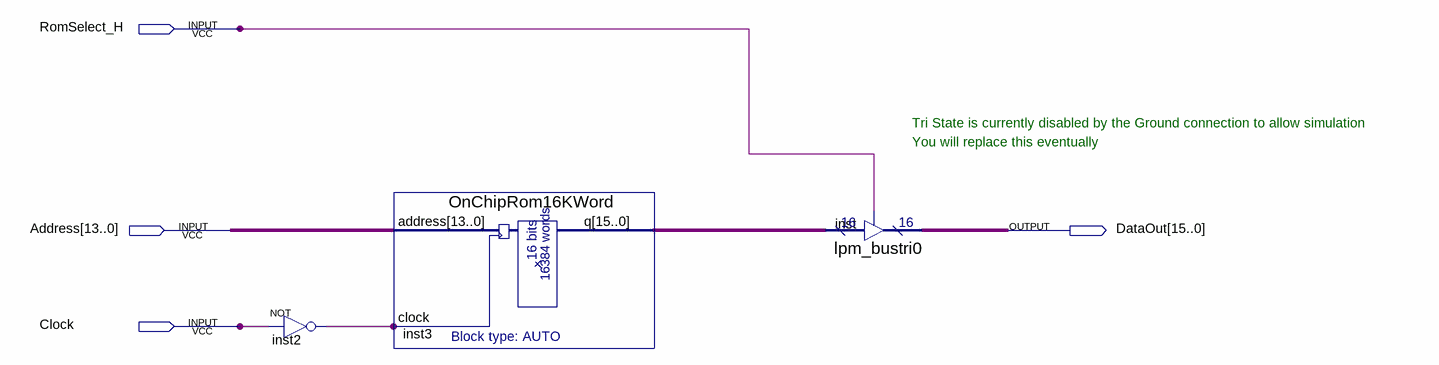
[diagram p0: schematic sheet]
// Quartus schematic OnChipROM16KWords.bdf as structural Verilog: 3 symbols, 4 pins
module OnChipROM16KWords (
  input  RomSelect_H,
  input  [13:0] Address,
  input  Clock,
  output [15:0] DataOut
);

  wire inst2_out;
  wire [15:0] inst3_q;

  not inst2 (inst2_out, Clock);
  OnChipRom16KWord inst3 (.address(Address), .clock(inst2_out), .q(inst3_q));
  lpm_bustri0 inst (.enabledt(RomSelect_H), .data(inst3_q), .tridata(DataOut));

  // Notes on the sheet:
  //   Tri State is currently disabled by the Ground connection to allow simulation
  //   You will replace this eventually
endmodule
